# EAGLE design BreadBoard Power Supply DC 5V 3.3V (EAGLE 6.1)
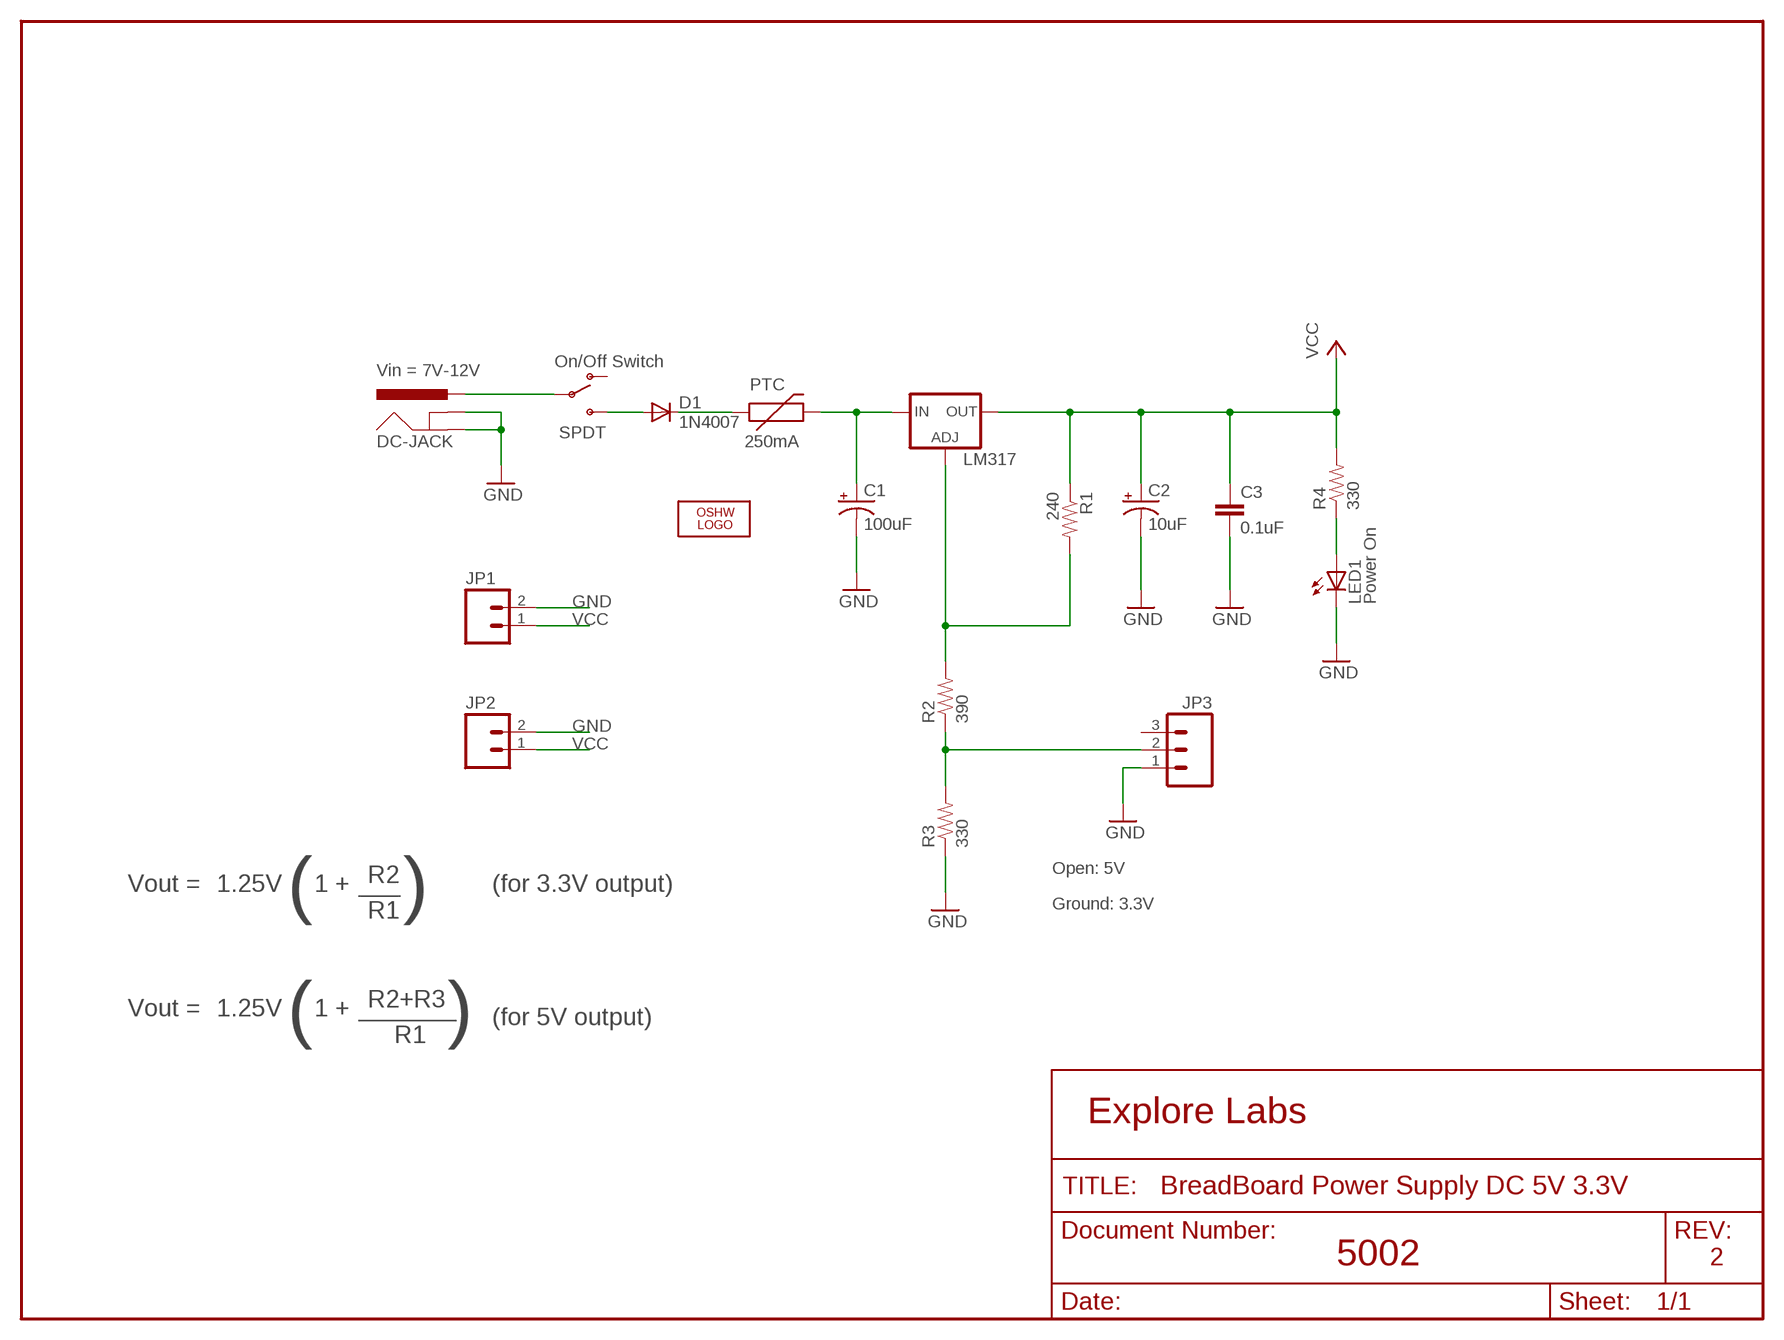
[diagram p0: schematic, sheet 1]

## Parts
C1  100uF  CAP_POLPTH2  [CPOL-RADIAL-10UF-25V]
C2  10uF  CAP_POLPTH2  [CPOL-RADIAL-10UF-25V]
C3  0.1uF  CAPPTH  [CAP-PTH-SMALL]
D1  1N4007  DIODE1N4148  [DIODE-1N4148]
DC-JACK  Vin = 7V-12V  POWER_JACKPTH  [POWER_JACK_PTH]
JP1  M02PTH  [1X02]
JP2  M02PTH  [1X02]
JP3  M03PTH  [1X03]
LED1  Power On  LED5MM  [LED5MM]
LM317  LM317TS  [317TS]
LOGO1  OSHW_LOGO_8MILX0150-NT  [OSHW_8X150_NOTEXT]
PTC  250mA  PTCPTH  [PTC]
R1  240  RESISTORPTH1  [AXIAL-0.3]
R2  390  RESISTORPTH1  [AXIAL-0.3]
R3  330  RESISTORPTH1  [AXIAL-0.3]
R4  330  RESISTORPTH1  [AXIAL-0.3]
SPDT  On/Off Switch  SWITCH-SPSTPTH  [SWITCH-SPDT]

## Nets
GND: C1.2(-) C2.2(-) C3.2 DC-JACK.GND DC-JACK.GNDBREAK JP1.2 JP2.2 JP3.1 LED1.K(C) R3.P$1
N$1: C1.1(+) LM317.3(IN) PTC.P$2
N$2: DC-JACK.PWR SPDT.2(P)
N$3: D1.A SPDT.3(S)
N$6: LM317.1(ADJ) R1.P$2 R2.P$2
N$7: JP3.2 R2.P$1 R3.P$2
N$8: LED1.A R4.P$1
N$9: D1.C PTC.P$1
VCC: C2.1(+) C3.1 JP1.1 JP2.1 LM317.2(OUT) R1.P$1 R4.P$2
Unconnected: JP3.3 SPDT.1(O)

## Notes on the sheet
- Open: 5V
- R2
- Vout = | 1.25V | 1 + | ___ | (for 3.3V output)
- ( | ) | Ground: 3.3V
- R1
- R2+R3
- Vout = | 1.25V | 1 + | _______
- (for 5V output)
- ( | )
- R1
- Explore Labs
- 5002 | 2

## Library data of the parts
C1 C2 = SparkFun:CAP_POL: Capacitor Polarized These are standard SMD and PTH capacitors. Normally 10uF, 47uF, and 100uF in electrolytic and tantalum varieties. Always verify the external diameter of the through hole cap, it varies with capacity, voltage, and manufacturer. The EIA devices should be standard.
C3 = SparkFun:CAP: Capacitor Standard 0603 ceramic capacitor, and 0.1" leaded capacitor.
D1 = SparkFun:DIODE: Diode These are standard reverse protection diodes and small signal diodes. SMA package can handle up to about 1A. SOD-323 can handle about 200mA. What the SOD-323 package when ordering, there are some mfgs out there that are 5-pin packages.
DC-JACK = SparkFun:POWER_JACK: Power Jack This is the standard 5.5mm barrel jack for power. The PTH is the most common, proven, reliable, footprint. All others are experimental. The Slot footprint only works if the mill layer is transmitted to the PCB fab house so be warned. Spark Fun Electronics SKU : PRT-00119. Mating wall wart : TOL-00298 (and others)
JP1 JP2 = SparkFun:M02: Header 2 Standard 2-pin 0.1" header. Use with straight break away headers (SKU : PRT-00116), right angle break away headers (PRT-00553), swiss pins (PRT-00743), machine pins (PRT-00117), and female headers (PRT-00115). Molex polarized connector foot print use with SKU : PRT-08233 with associated crimp pins and housings.
JP3 = SparkFun:M03: Header 3 Standard 3-pin 0.1" header. Use with straight break away headers (SKU : PRT-00116), right angle break away headers (PRT-00553), swiss pins (PRT-00743), machine pins (PRT-00117), and female headers (PRT-00115). Molex polarized connector foot print use with SKU : PRT-08232 with associated crimp pins and housings.
LED1 = SparkFun:LED: LEDs Standard schematic elements and footprints for 5mm, 3mm, 1206, and 0603 sized LEDs. 5mm - Spark Fun Electronics SKU : COM-00529 (and others)
LM317 = v-reg:LM317TS: VOLTAGE REGULATOR
LOGO1 = OSHW:OSHW_LOGO_8MIL
PTC = SparkFun:PTC: Resettable Fuse PTC Resettable Fuse. Spark Fun Electronics SKU : COM-08357
R1-R4 = SparkFun:RESISTOR: Resistor Basic schematic elements and footprints for 0603, 1206, and PTH 1/10th watt (small) resistors.
SPDT = SparkFun:SWITCH-SPST: SPST Switch Simple slide switch. Spark Fun Electronics SKU : COM-00102

## Board
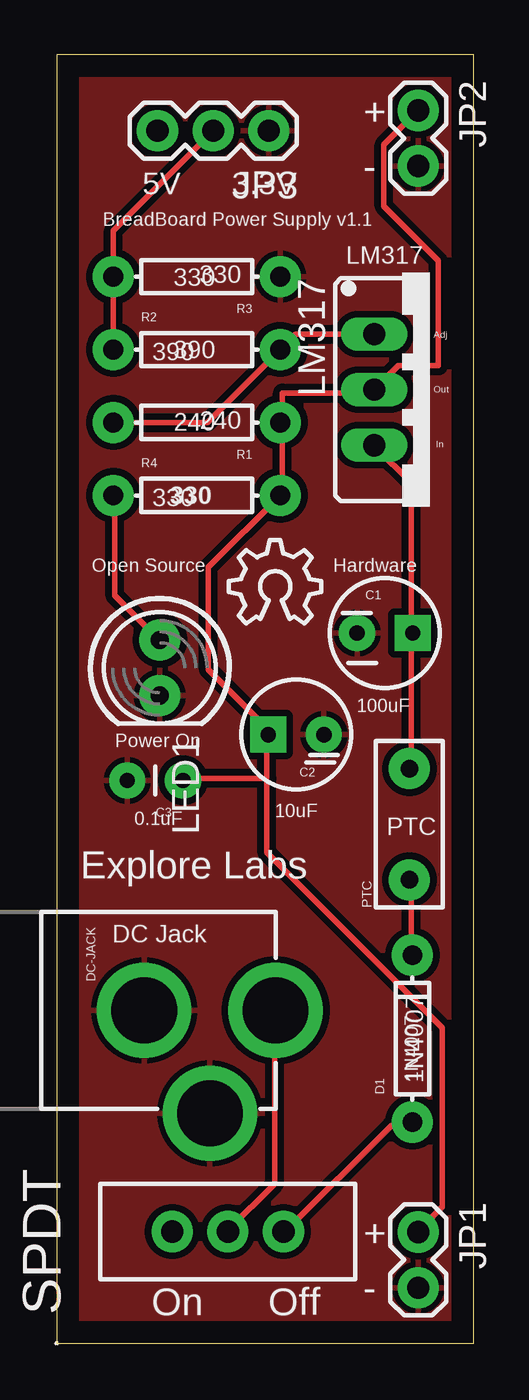
[diagram p1: board, top side]
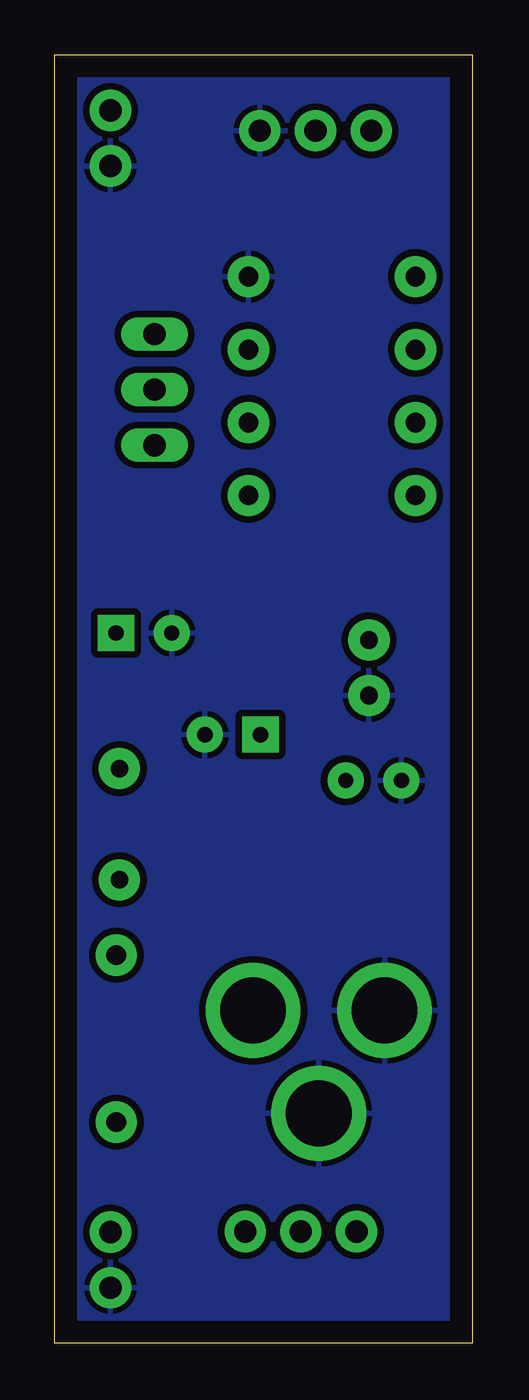
[diagram p2: board, bottom side, seen from below]

Size 19.05 x 58.83 mm. Coordinates in mm from the lower left corner, seen from the top.
Outline: 0,0 19.05,0 19.05,58.83 0,58.83 0,0
Copper layers (1*16): Top 0.035mm / dielectric 1.5mm / Bottom 0.035mm
Design rules: minimum track width 10mil, minimum drill 24mil, track to track 8mil, track to pad 8mil, pad to pad 8mil, via to via 8mil, smd to smd 8mil, copper to edge 40mil, drill to drill 8mil, minimum pad ring 10mil, minimum via ring 8mil, stop-mask expansion 4mil, vias tented up to drill 0mil, thermal gap 10mil

### Footprints (pad centres in the part's own frame; a part is rotated, then mirrored left to right if it is on the bottom)
CPOL-RADIAL-10UF-25V = drill 0.7 pad 1.651 square: 1 1.27,0 | drill 0.7 pad 1.651: 2 -1.27,0
CAP-PTH-SMALL = drill 0.7 pad 1.651: 1 0,0; 2 2.54,0
DIODE-1N4148 = drill 0.9 pad 1.88: A -3.81,0; C 3.81,0
POWER_JACK_PTH = drill 2.997 pad 4.318: GND 0,7.7; GNDBREAK 4.7,10.7; PWR 0,13.7
1X02 = drill 1.016 pad 1.88: 1 0,0; 2 2.54,0
1X03 = drill 1.016 pad 1.88: 1 0,0; 2 2.54,0; 3 5.08,0
LED5MM = drill 0.813 pad 1.88: A -1.27,0; K 1.27,0
317TS = drill 1.016 long: 1 -2.54,-2.54; 2 0,-2.54; 3 2.54,-2.54
PTC = drill 0.8 pad 1.88: P$1 -2.54,0; P$2 2.54,0
AXIAL-0.3 = drill 0.9 pad 1.88: P$1 -3.81,0; P$2 3.81,0
SWITCH-SPDT = drill 1.016 pad 1.88: 1 0,2.54; 2 0,0; 3 0,-2.54

### Placement (x,y rotation side)
C1  14.98,32.43 0 top
C2  10.93,27.79 180 top
C3  5.77,25.7 180 top
D1  16.24,13.91 90 top
DC-JACK  -3.7,15.2 270 top
JP1  16.51,5.08 270 top
JP2  16.51,56.29 270 top
JP3  9.69,55.36 180 top
LED1  4.71,30.84 270 top
LM317  17.04,43.54 270 top
LOGO1  7.85,32.87 0 top
PTC  16.1,23.7 90 top
R1  6.4,42.04 180 top
R2  6.4,45.37 0 top
R3  6.4,48.7 180 top
R4  6.4,38.71 0 top
SPDT  7.82,5.11 90 top

### Tracks (layer width: path | path; a pad name or v marks a point on that pad's centre or on a via)
GND
  pour Bottom (isolate 0.305): 0,58.85 0,0 19.02,0 19.02,58.85
  pour Top (isolate 0.305): 0,58.85 0,0 19.02,0 19.02,58.85
N$1
  Top 0.254: LM317.3 14.58,40.89 16.18,39.29 16.18,32.54 C1.1 16.18,32.36 16.18,26.31 PTC.P$2
N$2
  Top 0.254: SPDT.2 7.82,5.16 9.96,7.29 9.96,15.11 DC-JACK.PWR
N$3
  Top 0.254: SPDT.3 10.49,5.16 15.29,9.96 16.18,9.96 D1.A
N$5
  Top 0.005: 0.02,-0.05 arc10 0.03,-0.04 | 0.04,-0.03 arc19 0.05,-0.01 | 0.05,0.01 arc19 0.04,0.03 | 0.03,0.04 arc19 0.01,0.05 | -0.03,0.04 arc-19 -0.01,0.05 | -0.05,0.01 arc-19 -0.04,0.03 | -0.04,-0.03 arc-19 -0.05,-0.01 | -0.02,-0.05 arc-10 -0.03,-0.04 | -0.02,0 arc68 -0.01,-0.02 | 0.01,-0.02 arc248 -0.02,0 | 0.02,-0.05 arc10 0.03,-0.04 | 0.03,-0.04 0.05,-0.06 0.06,-0.05 0.04,-0.03 | 0.04,-0.03 arc19 0.05,-0.01 | 0.05,-0.01 0.08,-0.01 0.08,0.01 0.05,0.01 | 0.05,0.01 arc19 0.04,0.03 | 0.04,0.03 0.06,0.05 0.05,0.06 0.03,0.04 | 0.03,0.04 arc19 0.01,0.05 | 0.01,0.05 0.01,0.08 -0.01,0.08 -0.01,0.05 | -0.03,0.04 arc-19 -0.01,0.05 | -0.03,0.04 -0.05,0.06 -0.06,0.05 -0.04,0.03 | -0.05,0.01 arc-19 -0.04,0.03 | -0.05,0.01 -0.08,0.01 -0.08,-0.01 -0.05,-0.01 | -0.04,-0.03 arc-19 -0.05,-0.01 | -0.04,-0.03 -0.06,-0.05 -0.05,-0.06 -0.03,-0.04 | -0.02,-0.05 arc-10 -0.03,-0.04 | -0.01,-0.02 -0.02,-0.05 | -0.02,0 arc68 -0.01,-0.02 | 0.01,-0.02 arc248 -0.02,0 | 0.01,-0.02 0.02,-0.05
N$6
  Top 0.254: LM317.1 10.92,46.08 R2.P$2 6.88,42.04 R1.P$2
N$7
  Top 0.178: R3.P$2 2.59,48.72
  Top 0.254: JP3.2 2.59,50.8 2.59,48.72 2.67,48.72 R3.P$2 R2.P$1
N$8
  Top 0.254: LED1.A 4.62,32.18 2.67,34.14 2.67,38.58 R4.P$1
N$9
  Top 0.254: PTC.P$1 16.18,21.16 16.18,17.78 D1.C
VCC
  Top 0.178: C2.1 9.66,28.03
  Top 0.254: 9.6,25.78 5.87,25.78 C3.1 | 9.6,25.78 9.6,27.74 C2.1 | 9.6,25.78 9.6,22.4 17.6,14.4 17.6,6.22 16.54,5.16 JP1.1 | 9.66,28.03 6.93,30.76 6.93,35.43 R4.P$2 10.31,38.76 10.31,41.96 R1.P$1 10.31,42.14 10.31,43.38 14.4,43.38 LM317.2 15.59,44.63 17.42,44.63 17.42,49.43 14.94,51.92 14.94,54.72 JP2.1

### Text on the board
_tsilk: + | - | 5V | 3.3V | BreadBoard Power Supply v1.1 | LM317 | 330 | Adj | 390 | Out | 240 | In | 330 | Open Source | Hardware | 100uF | Power On | 0.1uF | 10uF | PTC | Explore Labs | DC Jack | 1N4007 | + | - | On | Off